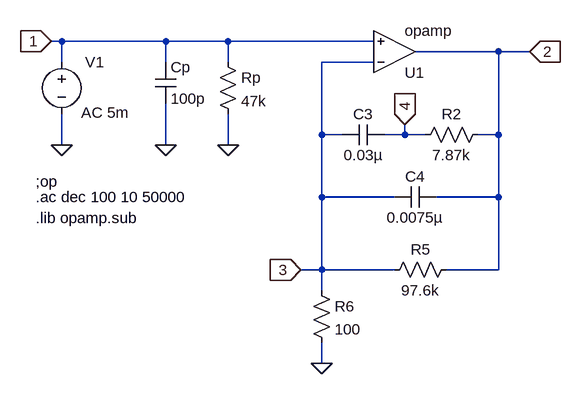
[diagram p0: schematic Op Amp Lipshitz_c Preamp V1.asc]
Op Amp Lipshitz_c Preamp V1.asc, the LTspice schematic file:
Version 4
SHEET 1 1876 1124
WIRE -272 176 -288 176
WIRE -112 176 -272 176
WIRE -16 176 -112 176
WIRE 208 176 -16 176
WIRE 400 192 272 192
WIRE 448 192 400 192
WIRE -272 208 -272 176
WIRE -112 208 -112 176
WIRE -16 208 -16 176
WIRE 208 208 128 208
WIRE 128 320 128 208
WIRE 160 320 128 320
WIRE 256 320 256 304
WIRE 256 320 224 320
WIRE 288 320 256 320
WIRE 400 320 400 192
WIRE 400 320 368 320
WIRE -272 336 -272 288
WIRE -112 336 -112 272
WIRE -16 336 -16 288
WIRE 128 416 128 320
WIRE 240 416 128 416
WIRE 400 416 400 320
WIRE 400 416 304 416
WIRE 128 528 128 416
WIRE 128 528 96 528
WIRE 240 528 128 528
WIRE 400 528 400 416
WIRE 400 528 320 528
WIRE 128 560 128 528
WIRE 128 672 128 640
FLAG -272 336 0
FLAG -288 176 1
IOPIN -288 176 In
FLAG -112 336 0
FLAG -16 336 0
FLAG 448 192 2
IOPIN 448 192 In
FLAG 256 304 4
IOPIN 256 304 In
FLAG 128 672 0
FLAG 96 528 3
IOPIN 96 528 In
SYMBOL voltage -272 192 R0
WINDOW 3 24 44 Left 2
WINDOW 123 30 94 Left 2
WINDOW 0 36 16 Left 2
WINDOW 39 0 0 Left 2
SYMATTR Value ""
SYMATTR Value2 AC 5m
SYMATTR InstName V1
SYMBOL cap -128 208 R0
SYMATTR InstName Cp
SYMATTR Value 100p
SYMBOL res -32 192 R0
SYMATTR InstName Rp
SYMATTR Value 47k
SYMBOL OpAmps\\opamp 240 256 M180
SYMATTR InstName U1
SYMBOL cap 224 304 R90
WINDOW 0 0 32 VBottom 2
WINDOW 3 32 32 VTop 2
SYMATTR InstName C3
SYMATTR Value 0.03µ
SYMBOL res 384 304 R90
WINDOW 0 0 56 VBottom 2
WINDOW 3 32 56 VTop 2
SYMATTR InstName R2
SYMATTR Value 7.87k
SYMBOL res 336 512 R90
WINDOW 0 0 56 VBottom 2
WINDOW 3 32 56 VTop 2
SYMATTR InstName R5
SYMATTR Value 97.6k
SYMBOL cap 304 400 R90
WINDOW 0 0 32 VBottom 2
WINDOW 3 32 32 VTop 2
SYMATTR InstName C4
SYMATTR Value 0.0075µ
SYMBOL res 112 544 R0
SYMATTR InstName R6
SYMATTR Value 100
TEXT -312 392 Left 2 !;op
TEXT -312 416 Left 2 !.ac dec 100 10 50000
TEXT -312 448 Left 2 !.lib opamp.sub

The netlist it stands for:
* Op Amp Lipshitz_c Preamp V1.asc
V1 1 0 AC 5m
Cp 1 0 100p
Rp 1 0 47k
XU1 3 1 2 opamp Aol=100K GBW=10Meg  ; pins invin noninvin out
C3 4 3 0.03µ
R2 2 4 7.87k
R5 2 3 97.6k
C4 2 3 0.0075µ
R6 3 0 100
;op
.ac dec 100 10 50000
.lib opamp.sub
.backanno
.end